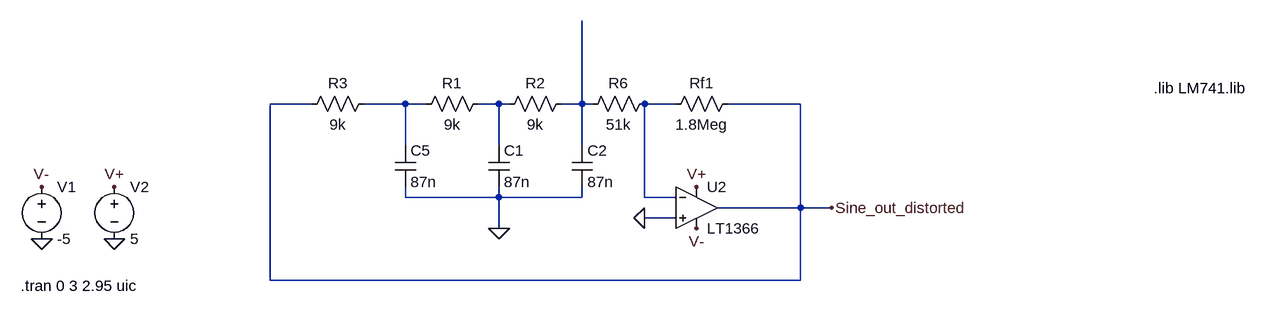
[diagram p0: schematic sinewave_generator.asc]
sinewave_generator.asc, the LTspice schematic file:
Version 4
SHEET 1 2944 680
WIRE 752 -32 688 -32
WIRE 896 -32 832 -32
WIRE 928 -32 896 -32
WIRE 1040 -32 1008 -32
WIRE 1056 -32 1040 -32
WIRE 1168 -32 1168 -160
WIRE 1168 -32 1136 -32
WIRE 1184 -32 1168 -32
WIRE 1312 -32 1264 -32
WIRE 1504 -32 1392 -32
WIRE 896 32 896 -32
WIRE 1040 32 1040 -32
WIRE 1168 32 1168 -32
WIRE 896 112 896 96
WIRE 1040 112 1040 96
WIRE 1040 112 896 112
WIRE 1168 112 1168 96
WIRE 1168 112 1040 112
WIRE 1264 112 1264 -32
WIRE 1312 112 1264 112
WIRE 1504 128 1504 -32
WIRE 1504 128 1376 128
WIRE 1552 128 1504 128
WIRE 1312 144 1264 144
WIRE 1040 160 1040 112
WIRE 688 240 688 -32
WIRE 1504 240 1504 128
WIRE 1504 240 688 240
FLAG 336 176 0
FLAG 448 176 0
FLAG 448 96 V+
FLAG 336 96 V-
FLAG 1344 160 V-
FLAG 1344 96 V+
FLAG 1552 128 Sine_out_distorted
FLAG 1264 144 0
FLAG 1040 160 0
SYMBOL voltage 336 80 R0
SYMATTR InstName V1
SYMATTR Value -5
SYMBOL voltage 448 80 R0
SYMATTR InstName V2
SYMATTR Value 5
SYMBOL LT1366 1344 64 R0
SYMATTR InstName U2
SYMBOL res 1408 -48 R90
WINDOW 0 0 56 VBottom 2
WINDOW 3 32 56 VTop 2
SYMATTR InstName Rf1
SYMATTR Value 1.8Meg
SYMBOL cap 880 32 R0
SYMATTR InstName C5
SYMATTR Value 87n
SYMBOL res 848 -48 R90
WINDOW 0 0 56 VBottom 2
WINDOW 3 32 56 VTop 2
SYMATTR InstName R3
SYMATTR Value 9k
SYMBOL res 1280 -48 R90
WINDOW 0 0 56 VBottom 2
WINDOW 3 32 56 VTop 2
SYMATTR InstName R6
SYMATTR Value 51k
SYMBOL cap 1024 32 R0
SYMATTR InstName C1
SYMATTR Value 87n
SYMBOL cap 1152 32 R0
SYMATTR InstName C2
SYMATTR Value 87n
SYMBOL res 1024 -48 R90
WINDOW 0 0 56 VBottom 2
WINDOW 3 32 56 VTop 2
SYMATTR InstName R1
SYMATTR Value 9k
SYMBOL res 1152 -48 R90
WINDOW 0 0 56 VBottom 2
WINDOW 3 32 56 VTop 2
SYMATTR InstName R2
SYMATTR Value 9k
TEXT 304 248 Left 2 !.tran 0 3 2.95 uic
TEXT 2048 -56 Left 2 !.lib LM741.lib

The netlist it stands for:
* sinewave_generator.asc
V1 V- 0 -5
V2 V+ 0 5
XU2 0 N004 V+ V- Sine_out_distorted LT1366  ; pins In+ In- V+ V- OUT
Rf1 Sine_out_distorted N004 1.8Meg
C5 N001 0 87n
R3 N001 Sine_out_distorted 9k
R6 N004 N003 51k
C1 N002 0 87n
C2 N003 0 87n
R1 N002 N001 9k
R2 N003 N002 9k
.tran 0 3 2.95 uic
.lib LM741.lib
.lib LTC.lib
.backanno
.end